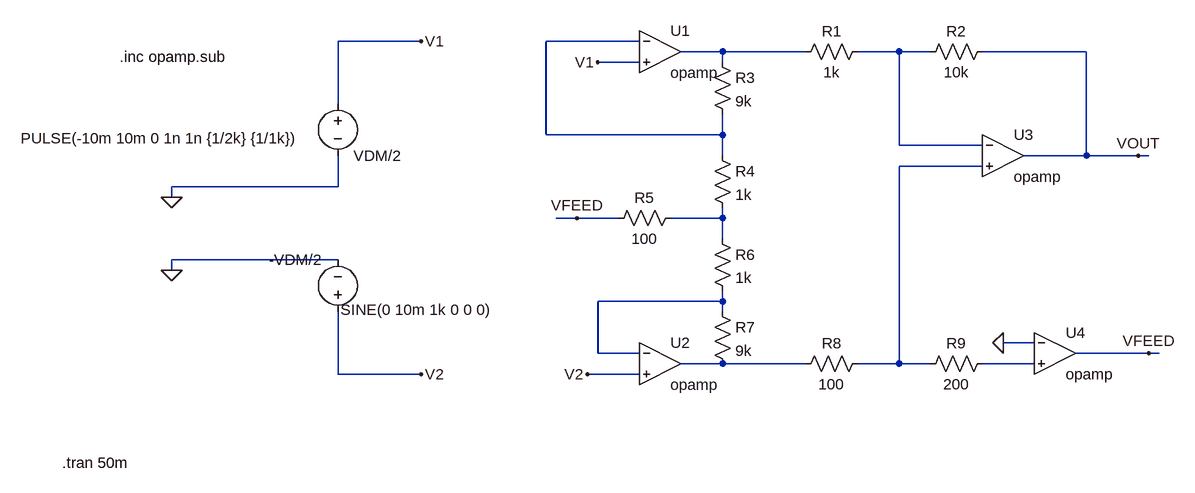
[diagram p0: schematic ej3_simulacion_ideal.asc]
ej3_simulacion_ideal.asc, the LTspice schematic file:
Version 4
SHEET 1 880 680
WIRE -304 0 -432 0
WIRE 32 0 -112 0
WIRE 160 16 96 16
WIRE 288 16 160 16
WIRE 432 16 368 16
WIRE 480 16 432 16
WIRE 720 16 560 16
WIRE 32 32 -32 32
WIRE 160 32 160 16
WIRE -432 96 -432 0
WIRE -112 144 -112 0
WIRE 160 144 160 112
WIRE 160 144 -112 144
WIRE 432 160 432 16
WIRE 560 160 432 160
WIRE 160 176 160 144
WIRE 720 176 720 16
WIRE 720 176 624 176
WIRE 800 176 720 176
WIRE 816 176 800 176
WIRE 560 192 432 192
WIRE -432 224 -432 176
WIRE -432 224 -688 224
WIRE -688 240 -688 224
WIRE -64 272 -96 272
WIRE 0 272 -64 272
WIRE 160 272 160 256
WIRE 160 272 80 272
WIRE 160 304 160 272
WIRE -432 336 -688 336
WIRE -688 352 -688 336
WIRE 160 400 160 384
WIRE 160 400 -32 400
WIRE 160 416 160 400
WIRE 640 464 592 464
WIRE -32 480 -32 400
WIRE 32 480 -32 480
WIRE 816 480 704 480
WIRE 832 480 816 480
WIRE 160 496 96 496
WIRE 288 496 160 496
WIRE 432 496 432 192
WIRE 432 496 368 496
WIRE 480 496 432 496
WIRE 640 496 560 496
WIRE -432 512 -432 416
WIRE -304 512 -432 512
WIRE 32 512 -48 512
FLAG -48 512 V2
FLAG 816 480 VFEED
FLAG -64 272 VFEED
FLAG 800 176 VOUT
FLAG -304 0 V1
FLAG -304 512 V2
FLAG -688 240 0
FLAG -688 352 0
FLAG -32 32 V1
FLAG 592 464 0
SYMBOL Opamps\\opamp 64 432 R0
SYMATTR InstName U2
SYMBOL res 144 16 R0
SYMATTR InstName R3
SYMATTR Value 9k
SYMBOL res 144 160 R0
SYMATTR InstName R4
SYMATTR Value 1k
SYMBOL res 144 288 R0
SYMATTR InstName R6
SYMATTR Value 1k
SYMBOL res 144 400 R0
SYMATTR InstName R7
SYMATTR Value 9k
SYMBOL res 384 0 R90
WINDOW 0 0 56 VBottom 2
WINDOW 3 32 56 VTop 2
SYMATTR InstName R1
SYMATTR Value 1k
SYMBOL res 384 480 R90
WINDOW 0 0 56 VBottom 2
WINDOW 3 32 56 VTop 2
SYMATTR InstName R8
SYMATTR Value 100
SYMBOL res 576 0 R90
WINDOW 0 0 56 VBottom 2
WINDOW 3 32 56 VTop 2
SYMATTR InstName R2
SYMATTR Value 10k
SYMBOL res 576 480 R90
WINDOW 0 0 56 VBottom 2
WINDOW 3 32 56 VTop 2
SYMATTR InstName R9
SYMATTR Value 200
SYMBOL Opamps\\opamp 592 112 R0
SYMATTR InstName U3
SYMBOL res 96 256 R90
WINDOW 0 0 56 VBottom 2
WINDOW 3 32 56 VTop 2
SYMATTR InstName R5
SYMATTR Value 100
SYMBOL voltage -432 80 R0
WINDOW 0 24 96 Left 2
WINDOW 3 -488 69 Left 2
WINDOW 123 0 0 Left 2
WINDOW 39 0 0 Left 2
SYMATTR InstName VDM/2
SYMATTR Value PULSE(-10m 10m 0 1n 1n {1/2k} {1/1k})
SYMBOL voltage -432 432 R180
WINDOW 0 24 96 Left 2
WINDOW 3 -237 19 Left 2
WINDOW 123 0 0 Left 2
WINDOW 39 0 0 Left 2
SYMATTR InstName -VDM/2
SYMATTR Value SINE(0 10m 1k 0 0 0)
SYMBOL Opamps\\opamp 64 -48 R0
SYMATTR InstName U1
SYMBOL Opamps\\opamp 672 416 R0
SYMATTR InstName U4
TEXT -856 648 Left 2 !.tran 50m
TEXT -768 24 Left 2 !.inc opamp.sub

The netlist it stands for:
* ej3_simulacion_ideal.asc
XU2 N006 V2 N007 opamp Aol=100K GBW=10Meg  ; pins invin noninvin out
R3 N002 N001 9k
R4 N001 N005 1k
R6 N005 N006 1k
R7 N006 N007 9k
R1 N003 N002 1k
R8 N004 N007 100
R2 VOUT N003 10k
R9 N008 N004 200
XU3 N003 N004 VOUT opamp Aol=100K GBW=10Meg  ; pins invin noninvin out
R5 N005 VFEED 100
VDM/2 V1 0 PULSE(-10m 10m 0 1n 1n {1/2k} {1/1k})
V§-VDM/2 V2 0 SINE(0 10m 1k 0 0 0)
XU1 N001 V1 N002 opamp Aol=100K GBW=10Meg  ; pins invin noninvin out
XU4 0 N008 VFEED opamp Aol=100K GBW=10Meg  ; pins invin noninvin out
.tran 50m
.inc opamp.sub
.backanno
.end